# Altium schematic sheet ETHERNET_TOP_LEVEL.SchDoc
size A4; DocumentNumber: 42; SheetNumber: 42; SheetTotal: 47
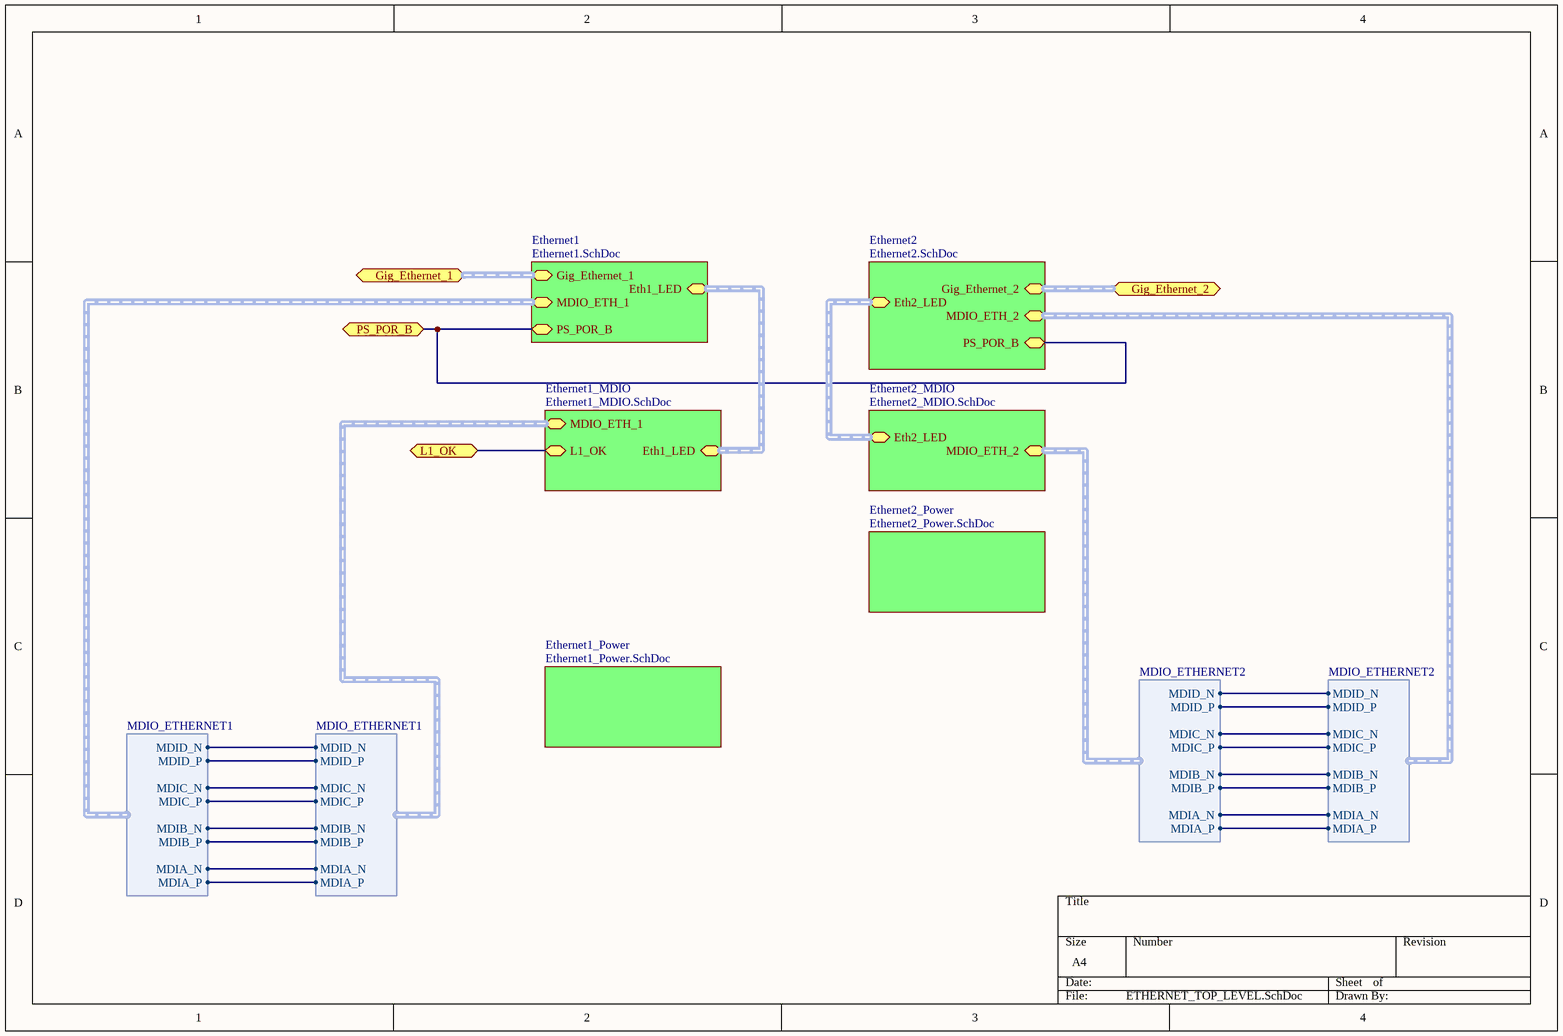
[diagram p0: ETHERNET_TOP_LEVEL.SchDoc]

## Sub-sheets
Ethernet1 = Ethernet1.SchDoc: Gig_Ethernet_1 (harness Gig_Ethernet1), MDIO_ETH_1 (harness MDIO_ETHERNET1), PS_POR_B (bidir), Eth1_LED (harness Eth1_LED)
Ethernet1_MDIO = Ethernet1_MDIO.SchDoc: MDIO_ETH_1 (harness MDIO_ETHERNET1), L1_OK, Eth1_LED (harness Eth1_LED)
Ethernet1_Power = Ethernet1_Power.SchDoc: no entries
Ethernet2 = Ethernet2.SchDoc: Gig_Ethernet_2 (harness Gig_Ethernet2), MDIO_ETH_2 (harness MDIO_ETHERNET2), PS_POR_B (bidir), Eth2_LED (harness Eth2_LED)
Ethernet2_MDIO = Ethernet2_MDIO.SchDoc: MDIO_ETH_2 (harness MDIO_ETHERNET2), Eth2_LED (harness Eth2_LED)
Ethernet2_Power = Ethernet2_Power.SchDoc: no entries

## Ports
Gig_Ethernet_1 (harness Gig_Ethernet1), Gig_Ethernet_2 (harness Gig_Ethernet2), L1_OK, PS_POR_B (bidir)

## Harnesses
MDIO_ETHERNET2: MDIA_P, MDIA_N, MDIB_P, MDIB_N, MDIC_P, MDIC_N, MDID_P, MDID_N
MDIO_ETHERNET1: MDIA_P, MDIA_N, MDIB_P, MDIB_N, MDIC_P, MDIC_N, MDID_P, MDID_N

## Nets
L1_OK: port L1_OK, sheet Ethernet1_MDIO/L1_OK
PS_POR_B: port PS_POR_B, sheet Ethernet1/PS_POR_B, sheet Ethernet2/PS_POR_B
(unnamed): sheet Ethernet2/MDIO_ETH_2.MDIA_P, sheet Ethernet2_MDIO/MDIO_ETH_2.MDIA_P
(unnamed): sheet Ethernet2/MDIO_ETH_2.MDIA_N, sheet Ethernet2_MDIO/MDIO_ETH_2.MDIA_N
(unnamed): sheet Ethernet2/MDIO_ETH_2.MDIB_P, sheet Ethernet2_MDIO/MDIO_ETH_2.MDIB_P
(unnamed): sheet Ethernet2/MDIO_ETH_2.MDIB_N, sheet Ethernet2_MDIO/MDIO_ETH_2.MDIB_N
(unnamed): sheet Ethernet2/MDIO_ETH_2.MDIC_P, sheet Ethernet2_MDIO/MDIO_ETH_2.MDIC_P
(unnamed): sheet Ethernet2/MDIO_ETH_2.MDIC_N, sheet Ethernet2_MDIO/MDIO_ETH_2.MDIC_N
(unnamed): sheet Ethernet2/MDIO_ETH_2.MDID_P, sheet Ethernet2_MDIO/MDIO_ETH_2.MDID_P
(unnamed): sheet Ethernet2/MDIO_ETH_2.MDID_N, sheet Ethernet2_MDIO/MDIO_ETH_2.MDID_N
(unnamed): sheet Ethernet1_MDIO/MDIO_ETH_1.MDIA_P, sheet Ethernet1/MDIO_ETH_1.MDIA_P
(unnamed): sheet Ethernet1_MDIO/MDIO_ETH_1.MDIA_N, sheet Ethernet1/MDIO_ETH_1.MDIA_N
(unnamed): sheet Ethernet1_MDIO/MDIO_ETH_1.MDIB_P, sheet Ethernet1/MDIO_ETH_1.MDIB_P
(unnamed): sheet Ethernet1_MDIO/MDIO_ETH_1.MDIB_N, sheet Ethernet1/MDIO_ETH_1.MDIB_N
(unnamed): sheet Ethernet1_MDIO/MDIO_ETH_1.MDIC_P, sheet Ethernet1/MDIO_ETH_1.MDIC_P
(unnamed): sheet Ethernet1_MDIO/MDIO_ETH_1.MDIC_N, sheet Ethernet1/MDIO_ETH_1.MDIC_N
(unnamed): sheet Ethernet1_MDIO/MDIO_ETH_1.MDID_P, sheet Ethernet1/MDIO_ETH_1.MDID_P
(unnamed): sheet Ethernet1_MDIO/MDIO_ETH_1.MDID_N, sheet Ethernet1/MDIO_ETH_1.MDID_N

## Buses and harness runs
harness port Gig_Ethernet_1 = sheet Ethernet1/Gig_Ethernet_1
harness port Gig_Ethernet_2 = sheet Ethernet2/Gig_Ethernet_2
harness sheet Ethernet1/Eth1_LED = sheet Ethernet1_MDIO/Eth1_LED
harness sheet Ethernet2/Eth2_LED = sheet Ethernet2_MDIO/Eth2_LED